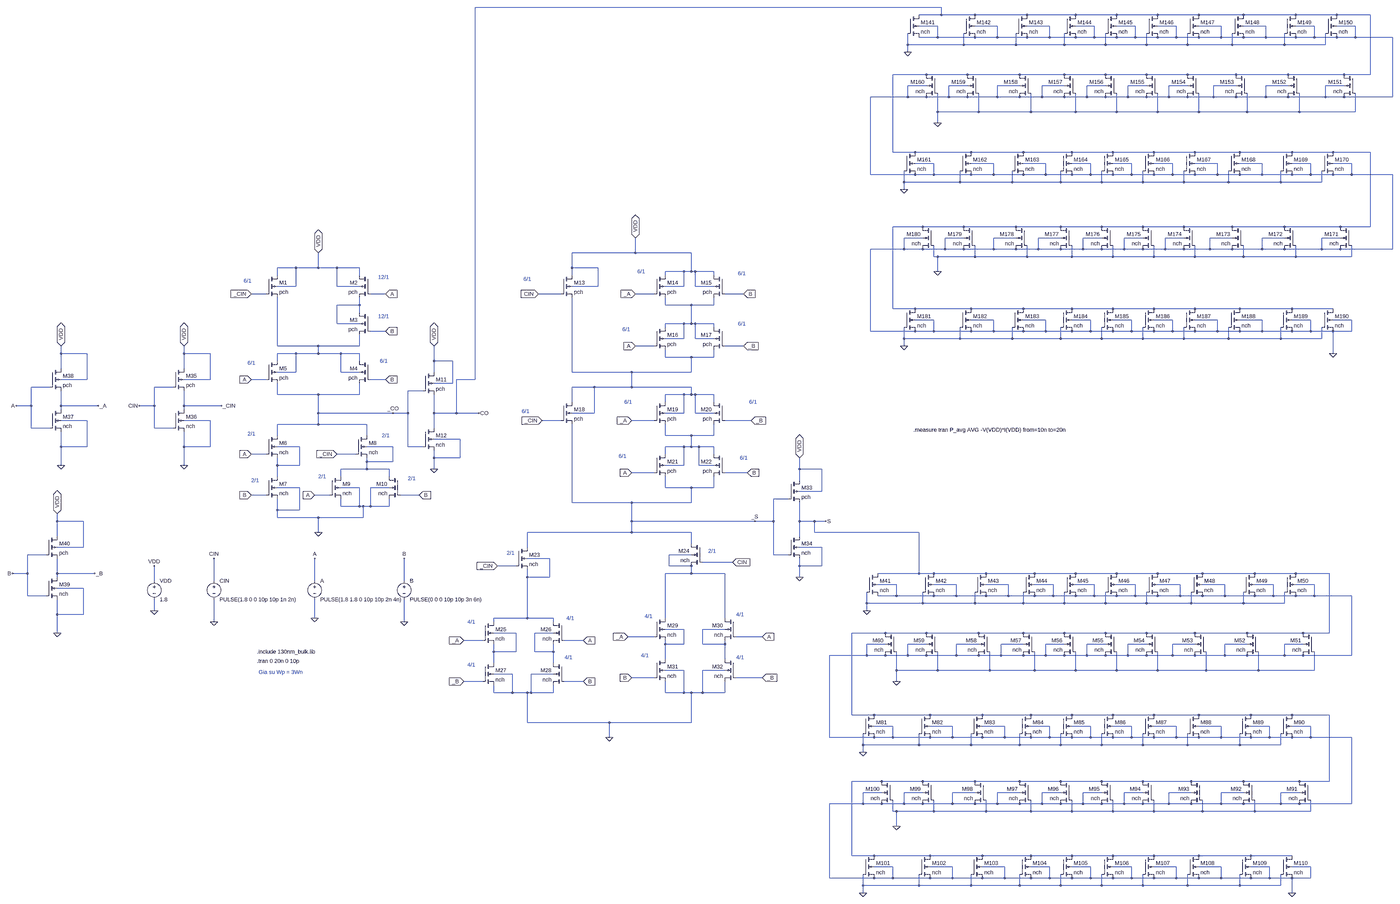
[diagram p0: schematic 22200162.asc, whole sheet]
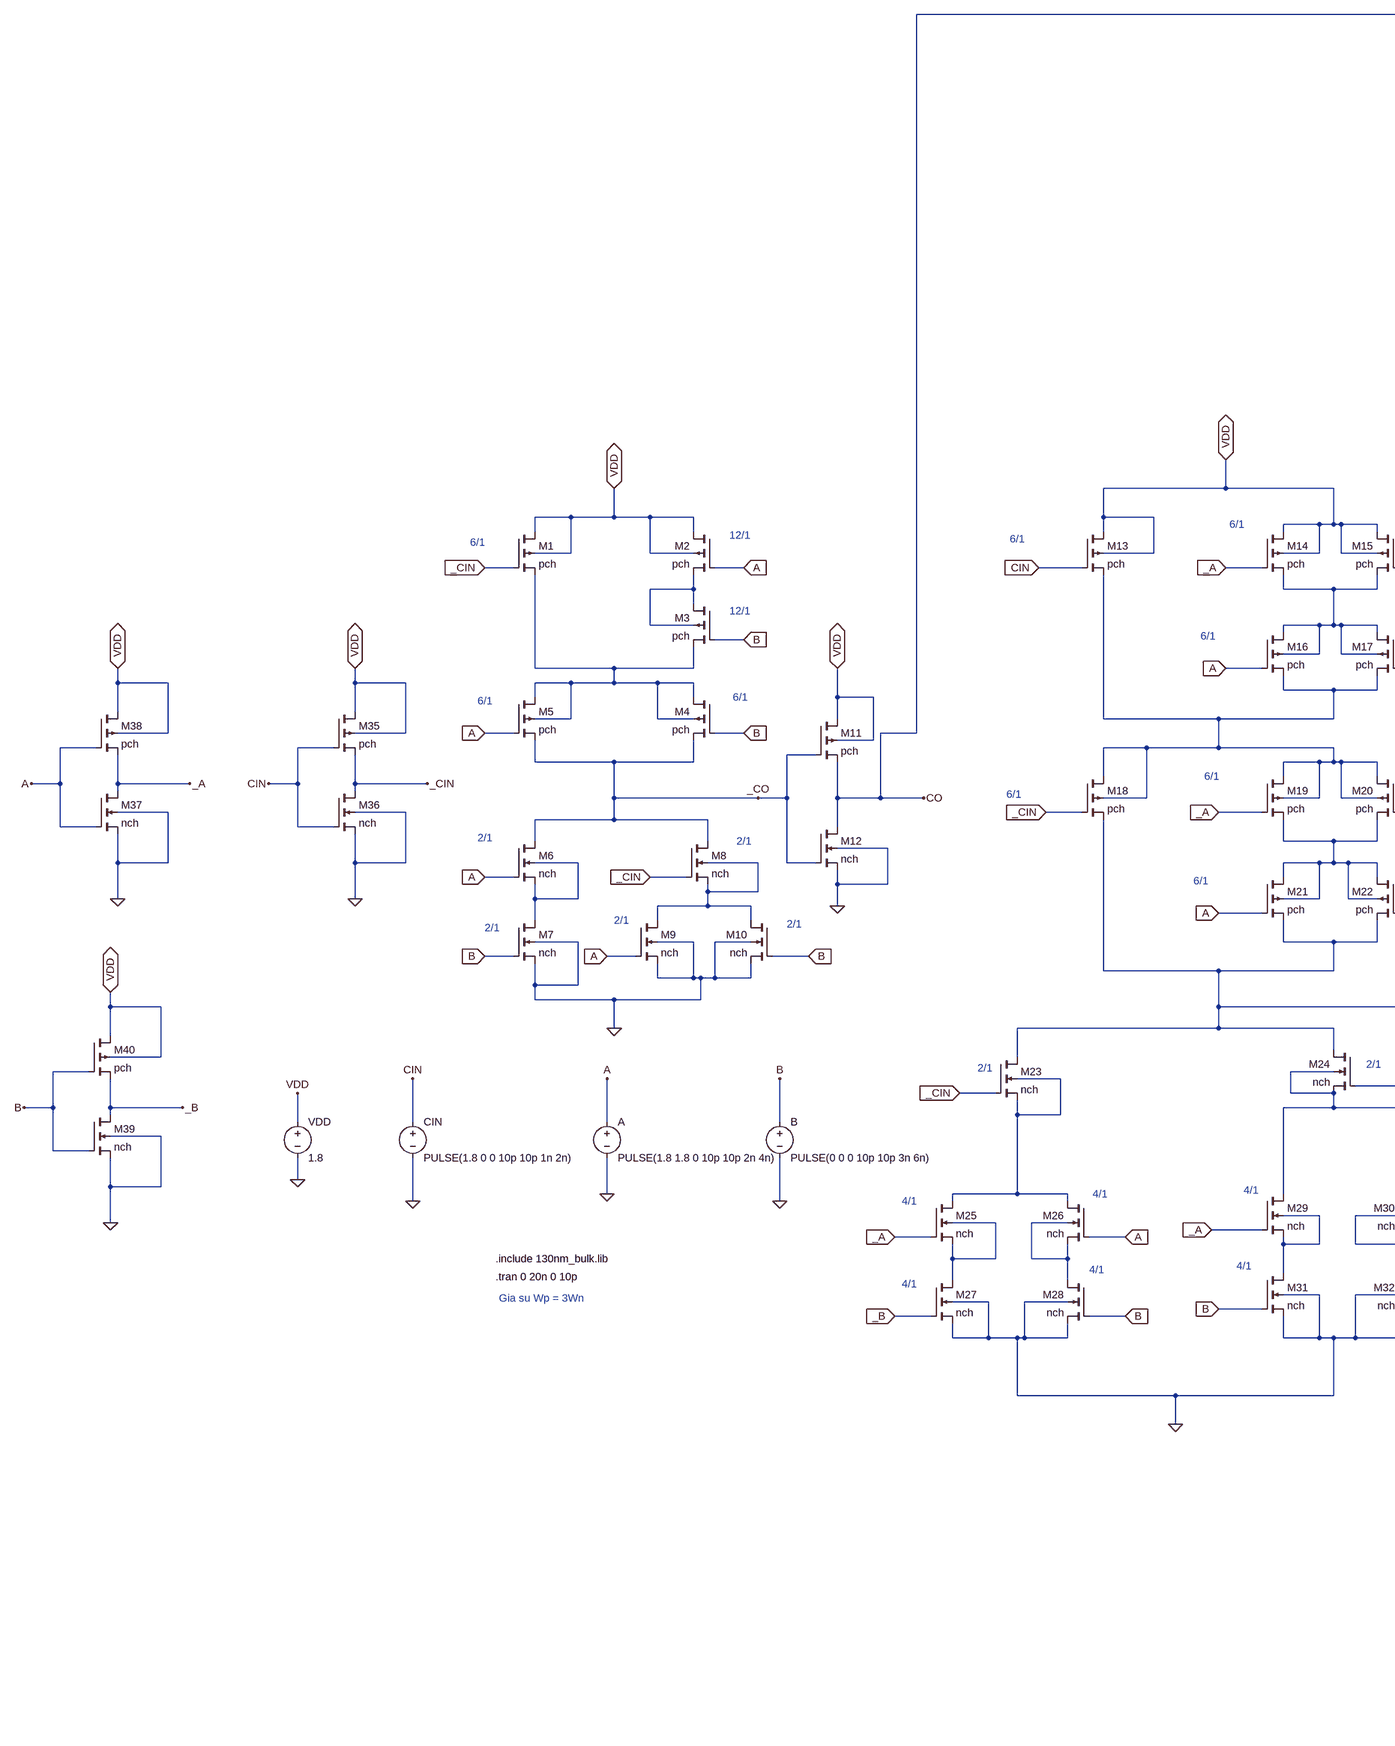
[diagram p1: schematic 22200162.asc, part, row 1 of 1, column 1 of 2]
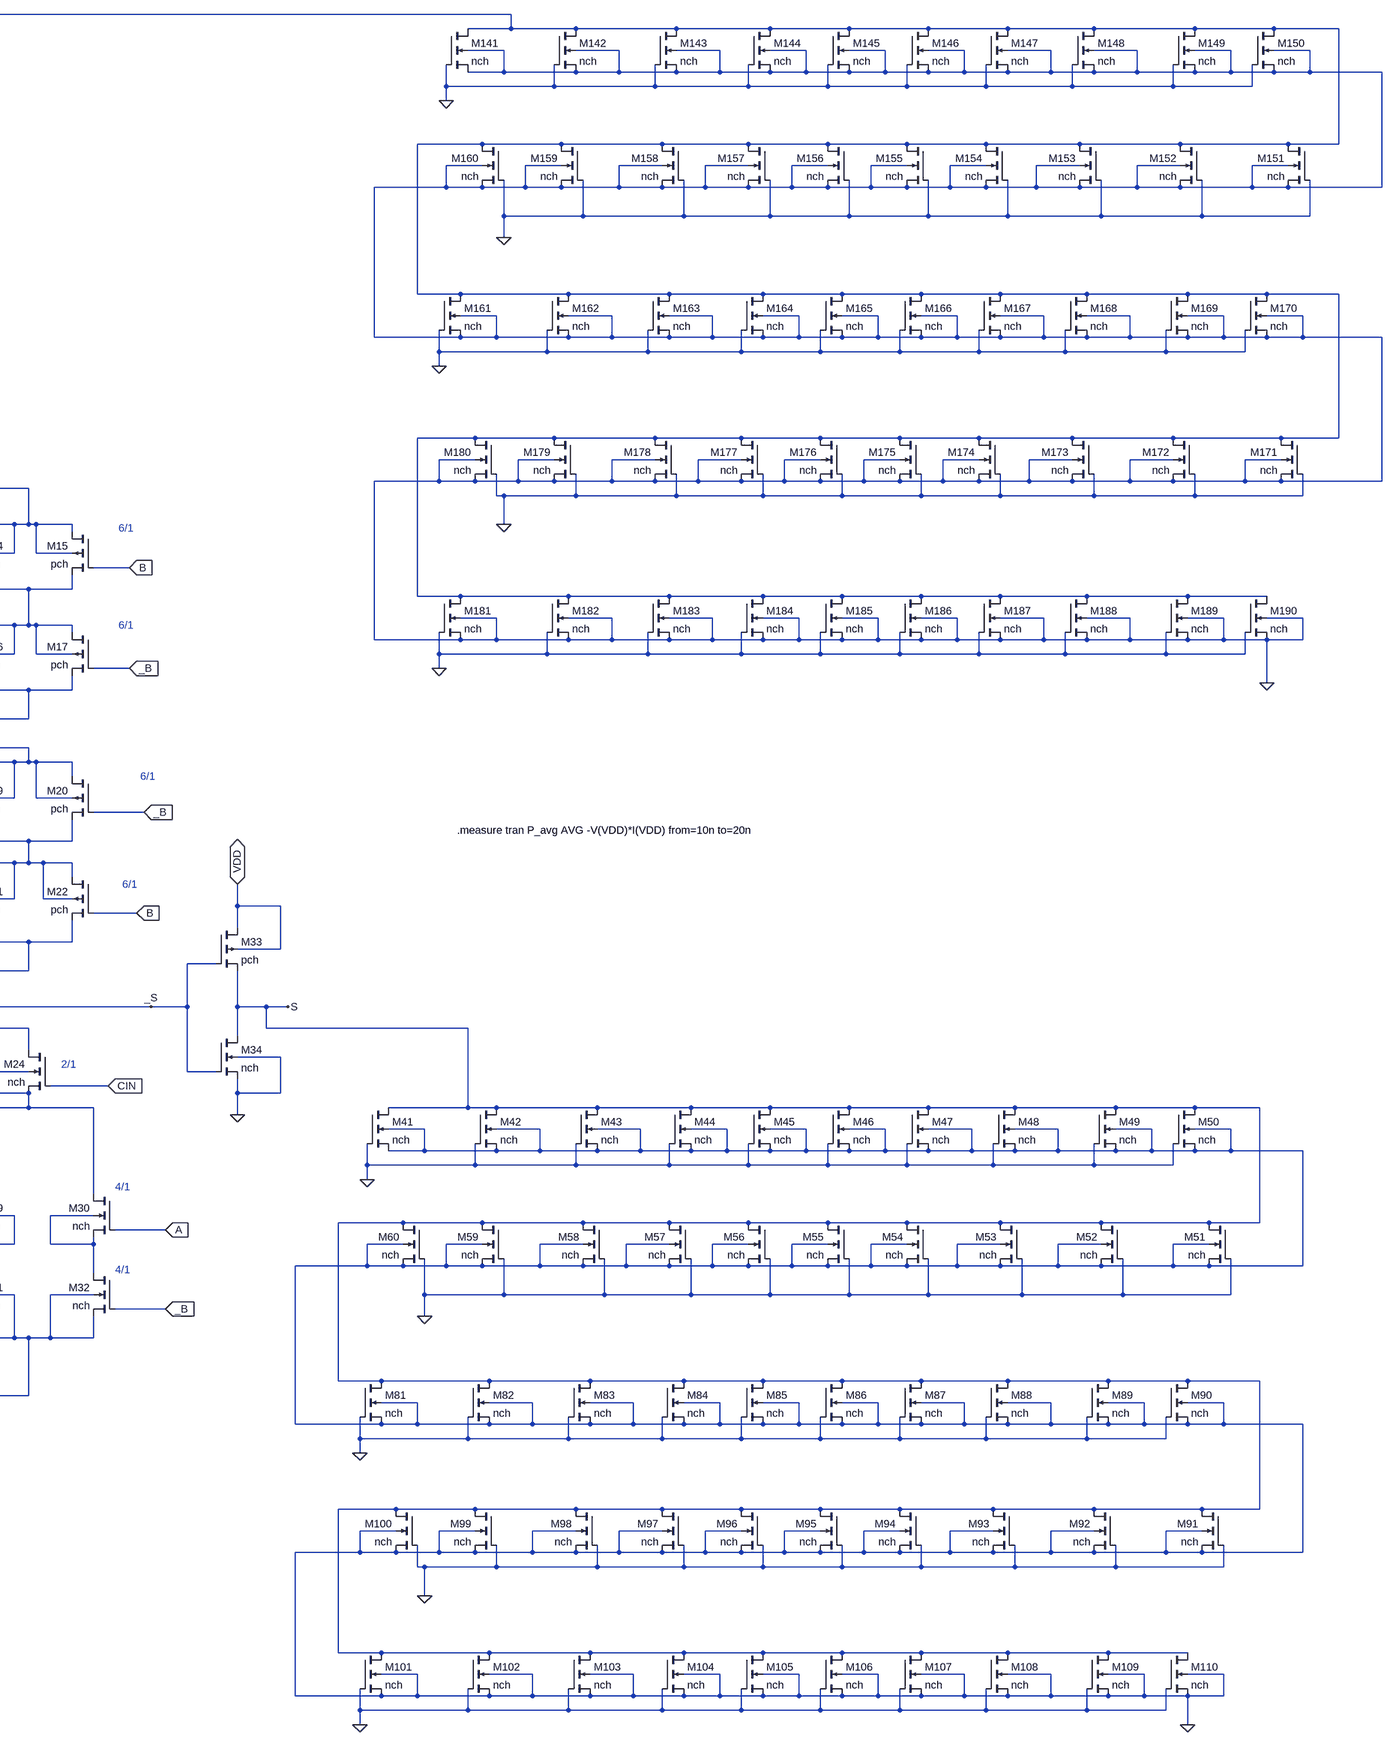
[diagram p2: schematic 22200162.asc, part, row 1 of 1, column 2 of 2]
22200162.asc, the LTspice schematic file:
Version 4.1
SHEET 1 7188 2788
WIRE 2864 -1120 864 -1120
WIRE 2864 -1088 2864 -1120
WIRE 2864 -1088 2768 -1088
WIRE 3008 -1088 2864 -1088
WIRE 3232 -1088 3008 -1088
WIRE 3440 -1088 3232 -1088
WIRE 3616 -1088 3440 -1088
WIRE 3792 -1088 3616 -1088
WIRE 3968 -1088 3792 -1088
WIRE 4160 -1088 3968 -1088
WIRE 4384 -1088 4160 -1088
WIRE 4560 -1088 4384 -1088
WIRE 4704 -1088 4560 -1088
WIRE 2848 -1040 2768 -1040
WIRE 3104 -1040 3008 -1040
WIRE 3328 -1040 3232 -1040
WIRE 3520 -1040 3440 -1040
WIRE 3696 -1040 3616 -1040
WIRE 3872 -1040 3792 -1040
WIRE 4064 -1040 3968 -1040
WIRE 4256 -1040 4160 -1040
WIRE 4464 -1040 4384 -1040
WIRE 4640 -1040 4560 -1040
WIRE 2848 -992 2848 -1040
WIRE 2848 -992 2768 -992
WIRE 3008 -992 2848 -992
WIRE 3104 -992 3104 -1040
WIRE 3104 -992 3008 -992
WIRE 3232 -992 3104 -992
WIRE 3328 -992 3328 -1040
WIRE 3328 -992 3232 -992
WIRE 3440 -992 3328 -992
WIRE 3520 -992 3520 -1040
WIRE 3520 -992 3440 -992
WIRE 3616 -992 3520 -992
WIRE 3696 -992 3696 -1040
WIRE 3696 -992 3616 -992
WIRE 3792 -992 3696 -992
WIRE 3872 -992 3872 -1040
WIRE 3872 -992 3792 -992
WIRE 3968 -992 3872 -992
WIRE 4064 -992 4064 -1040
WIRE 4064 -992 3968 -992
WIRE 4160 -992 4064 -992
WIRE 4256 -992 4256 -1040
WIRE 4256 -992 4160 -992
WIRE 4384 -992 4256 -992
WIRE 4464 -992 4464 -1040
WIRE 4464 -992 4384 -992
WIRE 4560 -992 4464 -992
WIRE 4640 -992 4640 -1040
WIRE 4640 -992 4560 -992
WIRE 4800 -992 4640 -992
WIRE 2720 -960 2720 -1008
WIRE 2960 -960 2960 -1008
WIRE 2960 -960 2720 -960
WIRE 3184 -960 3184 -1008
WIRE 3184 -960 2960 -960
WIRE 3392 -960 3392 -1008
WIRE 3392 -960 3184 -960
WIRE 3568 -960 3568 -1008
WIRE 3568 -960 3392 -960
WIRE 3744 -960 3744 -1008
WIRE 3744 -960 3568 -960
WIRE 3920 -960 3920 -1008
WIRE 3920 -960 3744 -960
WIRE 4112 -960 4112 -1008
WIRE 4112 -960 3920 -960
WIRE 4336 -960 4336 -1008
WIRE 4336 -960 4112 -960
WIRE 4512 -960 4512 -1008
WIRE 4512 -960 4336 -960
WIRE 2720 -928 2720 -960
WIRE 2800 -832 2656 -832
WIRE 2976 -832 2800 -832
WIRE 3200 -832 2976 -832
WIRE 3392 -832 3200 -832
WIRE 3568 -832 3392 -832
WIRE 3744 -832 3568 -832
WIRE 3920 -832 3744 -832
WIRE 4128 -832 3920 -832
WIRE 4352 -832 4128 -832
WIRE 4592 -832 4352 -832
WIRE 4704 -832 4704 -1088
WIRE 4704 -832 4592 -832
WIRE 2800 -784 2720 -784
WIRE 2976 -784 2896 -784
WIRE 3200 -784 3104 -784
WIRE 3392 -784 3296 -784
WIRE 3568 -784 3488 -784
WIRE 3744 -784 3664 -784
WIRE 3920 -784 3840 -784
WIRE 4128 -784 4032 -784
WIRE 4352 -784 4256 -784
WIRE 4592 -784 4512 -784
WIRE 2720 -736 2720 -784
WIRE 2720 -736 2560 -736
WIRE 2800 -736 2720 -736
WIRE 2896 -736 2896 -784
WIRE 2896 -736 2800 -736
WIRE 2976 -736 2896 -736
WIRE 3104 -736 3104 -784
WIRE 3104 -736 2976 -736
WIRE 3200 -736 3104 -736
WIRE 3296 -736 3296 -784
WIRE 3296 -736 3200 -736
WIRE 3392 -736 3296 -736
WIRE 3488 -736 3488 -784
WIRE 3488 -736 3392 -736
WIRE 3568 -736 3488 -736
WIRE 3664 -736 3664 -784
WIRE 3664 -736 3568 -736
WIRE 3744 -736 3664 -736
WIRE 3840 -736 3840 -784
WIRE 3840 -736 3744 -736
WIRE 3920 -736 3840 -736
WIRE 4032 -736 4032 -784
WIRE 4032 -736 3920 -736
WIRE 4128 -736 4032 -736
WIRE 4256 -736 4256 -784
WIRE 4256 -736 4128 -736
WIRE 4352 -736 4256 -736
WIRE 4512 -736 4512 -784
WIRE 4512 -736 4352 -736
WIRE 4592 -736 4512 -736
WIRE 4800 -736 4800 -992
WIRE 4800 -736 4592 -736
WIRE 2848 -672 2848 -752
WIRE 3024 -672 3024 -752
WIRE 3024 -672 2848 -672
WIRE 3248 -672 3248 -752
WIRE 3248 -672 3024 -672
WIRE 3440 -672 3440 -752
WIRE 3440 -672 3248 -672
WIRE 3616 -672 3616 -752
WIRE 3616 -672 3440 -672
WIRE 3792 -672 3792 -752
WIRE 3792 -672 3616 -672
WIRE 3968 -672 3968 -752
WIRE 3968 -672 3792 -672
WIRE 4176 -672 4176 -752
WIRE 4176 -672 3968 -672
WIRE 4400 -672 4400 -752
WIRE 4400 -672 4176 -672
WIRE 4640 -672 4640 -752
WIRE 4640 -672 4400 -672
WIRE 2848 -624 2848 -672
WIRE 2656 -480 2656 -832
WIRE 2752 -480 2656 -480
WIRE 2992 -480 2752 -480
WIRE 3216 -480 2992 -480
WIRE 3424 -480 3216 -480
WIRE 3600 -480 3424 -480
WIRE 3776 -480 3600 -480
WIRE 3952 -480 3776 -480
WIRE 4144 -480 3952 -480
WIRE 4368 -480 4144 -480
WIRE 4544 -480 4368 -480
WIRE 4704 -480 4544 -480
WIRE 2832 -432 2752 -432
WIRE 3088 -432 2992 -432
WIRE 3312 -432 3216 -432
WIRE 3504 -432 3424 -432
WIRE 3680 -432 3600 -432
WIRE 3856 -432 3776 -432
WIRE 4048 -432 3952 -432
WIRE 4240 -432 4144 -432
WIRE 4448 -432 4368 -432
WIRE 4624 -432 4544 -432
WIRE 2560 -384 2560 -736
WIRE 2752 -384 2560 -384
WIRE 2832 -384 2832 -432
WIRE 2832 -384 2752 -384
WIRE 2992 -384 2832 -384
WIRE 3088 -384 3088 -432
WIRE 3088 -384 2992 -384
WIRE 3216 -384 3088 -384
WIRE 3312 -384 3312 -432
WIRE 3312 -384 3216 -384
WIRE 3424 -384 3312 -384
WIRE 3504 -384 3504 -432
WIRE 3504 -384 3424 -384
WIRE 3600 -384 3504 -384
WIRE 3680 -384 3680 -432
WIRE 3680 -384 3600 -384
WIRE 3776 -384 3680 -384
WIRE 3856 -384 3856 -432
WIRE 3856 -384 3776 -384
WIRE 3952 -384 3856 -384
WIRE 4048 -384 4048 -432
WIRE 4048 -384 3952 -384
WIRE 4144 -384 4048 -384
WIRE 4240 -384 4240 -432
WIRE 4240 -384 4144 -384
WIRE 4368 -384 4240 -384
WIRE 4448 -384 4448 -432
WIRE 4448 -384 4368 -384
WIRE 4544 -384 4448 -384
WIRE 4624 -384 4624 -432
WIRE 4624 -384 4544 -384
WIRE 4800 -384 4624 -384
WIRE 2704 -352 2704 -400
WIRE 2944 -352 2944 -400
WIRE 2944 -352 2704 -352
WIRE 3168 -352 3168 -400
WIRE 3168 -352 2944 -352
WIRE 3376 -352 3376 -400
WIRE 3376 -352 3168 -352
WIRE 3552 -352 3552 -400
WIRE 3552 -352 3376 -352
WIRE 3728 -352 3728 -400
WIRE 3728 -352 3552 -352
WIRE 3904 -352 3904 -400
WIRE 3904 -352 3728 -352
WIRE 4096 -352 4096 -400
WIRE 4096 -352 3904 -352
WIRE 4320 -352 4320 -400
WIRE 4320 -352 4096 -352
WIRE 4496 -352 4496 -400
WIRE 4496 -352 4320 -352
WIRE 2704 -320 2704 -352
WIRE 2784 -160 2656 -160
WIRE 2960 -160 2784 -160
WIRE 3184 -160 2960 -160
WIRE 3376 -160 3184 -160
WIRE 3552 -160 3376 -160
WIRE 3728 -160 3552 -160
WIRE 3904 -160 3728 -160
WIRE 4112 -160 3904 -160
WIRE 4336 -160 4112 -160
WIRE 4576 -160 4336 -160
WIRE 4704 -160 4704 -480
WIRE 4704 -160 4576 -160
WIRE 2784 -112 2704 -112
WIRE 2960 -112 2880 -112
WIRE 3184 -112 3088 -112
WIRE 3376 -112 3280 -112
WIRE 3552 -112 3472 -112
WIRE 3728 -112 3648 -112
WIRE 3904 -112 3824 -112
WIRE 4112 -112 4016 -112
WIRE 4336 -112 4240 -112
WIRE 4576 -112 4496 -112
WIRE 2704 -64 2704 -112
WIRE 2704 -64 2560 -64
WIRE 2784 -64 2704 -64
WIRE 2880 -64 2880 -112
WIRE 2880 -64 2784 -64
WIRE 2960 -64 2880 -64
WIRE 3088 -64 3088 -112
WIRE 3088 -64 2960 -64
WIRE 3184 -64 3088 -64
WIRE 3280 -64 3280 -112
WIRE 3280 -64 3184 -64
WIRE 3376 -64 3280 -64
WIRE 3472 -64 3472 -112
WIRE 3472 -64 3376 -64
WIRE 3552 -64 3472 -64
WIRE 3648 -64 3648 -112
WIRE 3648 -64 3552 -64
WIRE 3728 -64 3648 -64
WIRE 3824 -64 3824 -112
WIRE 3824 -64 3728 -64
WIRE 3904 -64 3824 -64
WIRE 4016 -64 4016 -112
WIRE 4016 -64 3904 -64
WIRE 4112 -64 4016 -64
WIRE 4240 -64 4240 -112
WIRE 4240 -64 4112 -64
WIRE 4336 -64 4240 -64
WIRE 4496 -64 4496 -112
WIRE 4496 -64 4336 -64
WIRE 4576 -64 4496 -64
WIRE 4800 -64 4800 -384
WIRE 4800 -64 4576 -64
WIRE 1552 -48 1552 -112
WIRE 1552 -48 1280 -48
WIRE 1792 -48 1552 -48
WIRE 2832 -32 2832 -80
WIRE 2848 -32 2832 -32
WIRE 3008 -32 3008 -80
WIRE 3008 -32 2848 -32
WIRE 3232 -32 3232 -80
WIRE 3232 -32 3008 -32
WIRE 3424 -32 3424 -80
WIRE 3424 -32 3232 -32
WIRE 3600 -32 3600 -80
WIRE 3600 -32 3424 -32
WIRE 3776 -32 3776 -80
WIRE 3776 -32 3600 -32
WIRE 3952 -32 3952 -80
WIRE 3952 -32 3776 -32
WIRE 4160 -32 4160 -80
WIRE 4160 -32 3952 -32
WIRE 4384 -32 4384 -80
WIRE 4384 -32 4160 -32
WIRE 4624 -32 4624 -80
WIRE 4624 -32 4384 -32
WIRE 96 16 16 16
WIRE 192 16 192 -48
WIRE 192 16 96 16
WIRE 272 16 192 16
WIRE 368 16 272 16
WIRE 1280 16 1280 -48
WIRE 1392 16 1280 16
WIRE 1760 32 1680 32
WIRE 1792 32 1792 -48
WIRE 1792 32 1760 32
WIRE 1808 32 1792 32
WIRE 1888 32 1808 32
WIRE 2848 32 2848 -32
WIRE 16 48 16 16
WIRE 368 48 368 16
WIRE 1280 48 1280 16
WIRE 1680 48 1680 32
WIRE 1888 48 1888 32
WIRE 96 96 96 16
WIRE 96 96 16 96
WIRE 272 96 272 16
WIRE 368 96 272 96
WIRE 1392 96 1392 16
WIRE 1392 96 1280 96
WIRE 1760 96 1760 32
WIRE 1760 96 1680 96
WIRE 1808 96 1808 32
WIRE 1888 96 1808 96
WIRE -32 128 -96 128
WIRE 480 128 416 128
WIRE 1232 128 1136 128
WIRE 1632 128 1552 128
WIRE 2016 128 1936 128
WIRE 368 176 368 144
WIRE 368 176 272 176
WIRE 1680 176 1680 144
WIRE 1792 176 1680 176
WIRE 1888 176 1888 144
WIRE 1888 176 1792 176
WIRE 2656 192 2656 -160
WIRE 2752 192 2656 192
WIRE 2992 192 2752 192
WIRE 3216 192 2992 192
WIRE 3424 192 3216 192
WIRE 3600 192 3424 192
WIRE 3776 192 3600 192
WIRE 3952 192 3776 192
WIRE 4144 192 3952 192
WIRE 4368 192 4144 192
WIRE 4544 192 4368 192
WIRE 368 208 368 176
WIRE 2832 240 2752 240
WIRE 3088 240 2992 240
WIRE 3312 240 3216 240
WIRE 3504 240 3424 240
WIRE 3680 240 3600 240
WIRE 3856 240 3776 240
WIRE 4048 240 3952 240
WIRE 4240 240 4144 240
WIRE 4448 240 4368 240
WIRE 4624 240 4544 240
WIRE 272 256 272 176
WIRE 368 256 272 256
WIRE 1760 256 1680 256
WIRE 1792 256 1792 176
WIRE 1792 256 1760 256
WIRE 1808 256 1792 256
WIRE 1888 256 1808 256
WIRE 1680 272 1680 256
WIRE 1888 272 1888 256
WIRE 480 288 416 288
WIRE 2560 288 2560 -64
WIRE 2752 288 2560 288
WIRE 2832 288 2832 240
WIRE 2832 288 2752 288
WIRE 2992 288 2832 288
WIRE 3088 288 3088 240
WIRE 3088 288 2992 288
WIRE 3216 288 3088 288
WIRE 3312 288 3312 240
WIRE 3312 288 3216 288
WIRE 3424 288 3312 288
WIRE 3504 288 3504 240
WIRE 3504 288 3424 288
WIRE 3600 288 3504 288
WIRE 3680 288 3680 240
WIRE 3680 288 3600 288
WIRE 3776 288 3680 288
WIRE 3856 288 3856 240
WIRE 3856 288 3776 288
WIRE 3952 288 3856 288
WIRE 4048 288 4048 240
WIRE 4048 288 3952 288
WIRE 4144 288 4048 288
WIRE 4240 288 4240 240
WIRE 4240 288 4144 288
WIRE 4368 288 4240 288
WIRE 4448 288 4448 240
WIRE 4448 288 4368 288
WIRE 4544 288 4448 288
WIRE 4624 288 4624 240
WIRE 4624 288 4544 288
WIRE 1760 320 1760 256
WIRE 1760 320 1680 320
WIRE 1808 320 1808 256
WIRE 1888 320 1808 320
WIRE 2704 320 2704 272
WIRE 2944 320 2944 272
WIRE 2944 320 2704 320
WIRE 3168 320 3168 272
WIRE 3168 320 2944 320
WIRE 3376 320 3376 272
WIRE 3376 320 3168 320
WIRE 3552 320 3552 272
WIRE 3552 320 3376 320
WIRE 3728 320 3728 272
WIRE 3728 320 3552 320
WIRE 3904 320 3904 272
WIRE 3904 320 3728 320
WIRE 4096 320 4096 272
WIRE 4096 320 3904 320
WIRE 4320 320 4320 272
WIRE 4320 320 4096 320
WIRE 4496 320 4496 272
WIRE 4496 320 4320 320
WIRE 16 352 16 144
WIRE 192 352 16 352
WIRE 368 352 368 304
WIRE 368 352 192 352
WIRE 1632 352 1552 352
WIRE 2016 352 1936 352
WIRE 2704 352 2704 320
WIRE -912 384 -912 352
WIRE -800 384 -912 384
WIRE -384 384 -384 352
WIRE -272 384 -384 384
WIRE 96 384 16 384
WIRE 192 384 192 352
WIRE 192 384 96 384
WIRE 288 384 192 384
WIRE 368 384 288 384
WIRE 4544 384 4544 288
WIRE 1680 400 1680 368
WIRE 1792 400 1680 400
WIRE 1888 400 1888 368
WIRE 1888 400 1792 400
WIRE 16 416 16 384
WIRE 368 416 368 384
WIRE 688 416 688 352
WIRE 768 416 688 416
WIRE -912 448 -912 384
WIRE -384 448 -384 384
WIRE 96 464 96 384
WIRE 96 464 16 464
WIRE 288 464 288 384
WIRE 368 464 288 464
WIRE 688 464 688 416
WIRE 1280 464 1280 144
WIRE 1536 464 1280 464
WIRE 1792 464 1792 400
WIRE 1792 464 1536 464
WIRE -800 496 -800 384
WIRE -800 496 -912 496
WIRE -272 496 -272 384
WIRE -272 496 -384 496
WIRE -32 496 -96 496
WIRE 480 496 416 496
WIRE 864 496 864 -1120
WIRE 864 496 784 496
WIRE 768 512 768 416
WIRE 768 512 688 512
WIRE -960 528 -1040 528
WIRE -432 528 -512 528
WIRE 1376 528 1280 528
WIRE 1536 528 1536 464
WIRE 1536 528 1376 528
WIRE 1792 528 1536 528
WIRE 640 544 576 544
WIRE 16 560 16 512
WIRE 192 560 16 560
WIRE 368 560 368 512
WIRE 368 560 192 560
WIRE 1760 560 1680 560
WIRE 1792 560 1792 528
WIRE 1792 560 1760 560
WIRE 1808 560 1792 560
WIRE 1888 560 1808 560
WIRE 1280 592 1280 528
WIRE 1680 592 1680 560
WIRE 1888 592 1888 560
WIRE -1040 608 -1040 528
WIRE -1040 608 -1104 608
WIRE -912 608 -912 544
WIRE -752 608 -912 608
WIRE -512 608 -512 528
WIRE -512 608 -576 608
WIRE -384 608 -384 544
WIRE -224 608 -384 608
WIRE -912 624 -912 608
WIRE -384 624 -384 608
WIRE 192 640 192 560
WIRE 512 640 192 640
WIRE 576 640 576 544
WIRE 576 640 512 640
WIRE 688 640 688 560
WIRE 784 640 784 496
WIRE 784 640 688 640
WIRE 880 640 784 640
WIRE 1376 640 1376 528
WIRE 1376 640 1280 640
WIRE 1760 640 1760 560
WIRE 1760 640 1680 640
WIRE 1808 640 1808 560
WIRE 1888 640 1808 640
WIRE -800 672 -912 672
WIRE -272 672 -384 672
WIRE 1232 672 1152 672
WIRE 1632 672 1536 672
WIRE 2048 672 1936 672
WIRE 192 688 192 640
WIRE 192 688 16 688
WIRE 400 688 192 688
WIRE -1040 704 -1040 608
WIRE -960 704 -1040 704
WIRE -512 704 -512 608
WIRE -432 704 -512 704
WIRE 688 704 688 640
WIRE 16 736 16 688
WIRE 400 736 400 688
WIRE 1680 736 1680 688
WIRE 1792 736 1680 736
WIRE 1888 736 1888 688
WIRE 1888 736 1792 736
WIRE 800 752 688 752
WIRE -912 784 -912 720
WIRE -800 784 -800 672
WIRE -800 784 -912 784
WIRE -384 784 -384 720
WIRE -272 784 -272 672
WIRE -272 784 -384 784
WIRE 112 784 16 784
WIRE 512 784 400 784
WIRE 576 784 576 640
WIRE 640 784 576 784
WIRE 1760 784 1680 784
WIRE 1792 784 1792 736
WIRE 1792 784 1760 784
WIRE 1824 784 1792 784
WIRE 1888 784 1824 784
WIRE -32 816 -96 816
WIRE 352 816 272 816
WIRE 1680 816 1680 784
WIRE 1888 816 1888 784
WIRE 688 832 688 800
WIRE 800 832 800 752
WIRE 800 832 688 832
WIRE 400 848 400 832
WIRE 512 848 512 784
WIRE 512 848 400 848
WIRE -912 864 -912 784
WIRE -384 864 -384 784
WIRE 16 864 16 832
WIRE 112 864 112 784
WIRE 112 864 16 864
WIRE 1760 864 1760 784
WIRE 1760 864 1680 864
WIRE 1824 864 1824 784
WIRE 1888 864 1824 864
WIRE 400 880 400 848
WIRE 400 880 288 880
WIRE 496 880 400 880
WIRE 688 880 688 832
WIRE 2256 880 2256 832
WIRE 2352 880 2256 880
WIRE 1632 896 1536 896
WIRE 2032 896 1936 896
WIRE 16 912 16 864
WIRE 288 912 288 880
WIRE 496 912 496 880
WIRE 2256 928 2256 880
WIRE 112 960 16 960
WIRE 368 960 288 960
WIRE 496 960 416 960
WIRE 1680 960 1680 912
WIRE 1792 960 1680 960
WIRE 1888 960 1888 912
WIRE 1888 960 1792 960
WIRE 2352 976 2352 880
WIRE 2352 976 2256 976
WIRE -32 992 -96 992
WIRE 240 992 176 992
WIRE 624 992 544 992
WIRE 2208 1008 2144 1008
WIRE 1280 1024 1280 688
WIRE 1536 1024 1280 1024
WIRE 1792 1024 1792 960
WIRE 1792 1024 1536 1024
WIRE 288 1040 288 1008
WIRE 368 1040 368 960
WIRE 368 1040 288 1040
WIRE 384 1040 368 1040
WIRE 416 1040 416 960
WIRE 416 1040 384 1040
WIRE 496 1040 496 1008
WIRE 496 1040 416 1040
WIRE 16 1056 16 1008
WIRE 112 1056 112 960
WIRE 112 1056 16 1056
WIRE 16 1088 16 1056
WIRE 192 1088 16 1088
WIRE 384 1088 384 1040
WIRE 384 1088 192 1088
WIRE -928 1104 -928 1072
WIRE -816 1104 -928 1104
WIRE 1536 1104 1536 1024
WIRE 2064 1104 1536 1104
WIRE 2144 1104 2144 1008
WIRE 2144 1104 2064 1104
WIRE 2256 1104 2256 1024
WIRE 2320 1104 2256 1104
WIRE 2368 1104 2320 1104
WIRE 192 1152 192 1088
WIRE 1536 1152 1536 1104
WIRE 1536 1152 1088 1152
WIRE 1792 1152 1536 1152
WIRE 2320 1152 2320 1104
WIRE 2768 1152 2320 1152
WIRE -928 1168 -928 1104
WIRE 2256 1168 2256 1104
WIRE 1792 1200 1792 1152
WIRE -816 1216 -816 1104
WIRE -816 1216 -928 1216
WIRE 1088 1216 1088 1152
WIRE 2352 1216 2256 1216
WIRE -976 1248 -1056 1248
WIRE 1792 1248 1696 1248
WIRE 2144 1248 2144 1104
WIRE 2208 1248 2144 1248
WIRE 1184 1264 1088 1264
WIRE 1968 1280 1840 1280
WIRE 1040 1296 960 1296
WIRE 1696 1296 1696 1248
WIRE 1792 1296 1696 1296
WIRE 2256 1296 2256 1264
WIRE 2352 1296 2352 1216
WIRE 2352 1296 2256 1296
WIRE -1056 1328 -1056 1248
WIRE -1056 1328 -1120 1328
WIRE -928 1328 -928 1264
WIRE -768 1328 -928 1328
WIRE 1792 1328 1792 1296
WIRE 1792 1328 1680 1328
WIRE 1936 1328 1792 1328
WIRE 2768 1328 2768 1152
WIRE 2768 1328 2592 1328
WIRE 2832 1328 2768 1328
WIRE 3056 1328 2832 1328
WIRE 3264 1328 3056 1328
WIRE 3440 1328 3264 1328
WIRE 3616 1328 3440 1328
WIRE 3792 1328 3616 1328
WIRE 3984 1328 3792 1328
WIRE 4208 1328 3984 1328
WIRE 4384 1328 4208 1328
WIRE 4528 1328 4384 1328
WIRE -928 1344 -928 1328
WIRE 1088 1344 1088 1312
WIRE 1184 1344 1184 1264
WIRE 1184 1344 1088 1344
WIRE 2256 1344 2256 1296
WIRE -512 1360 -512 1296
WIRE -256 1360 -256 1264
WIRE 176 1360 176 1264
WIRE 560 1360 560 1264
WIRE 2672 1376 2592 1376
WIRE 2928 1376 2832 1376
WIRE 3152 1376 3056 1376
WIRE 3344 1376 3264 1376
WIRE 3520 1376 3440 1376
WIRE 3696 1376 3616 1376
WIRE 3888 1376 3792 1376
WIRE 4080 1376 3984 1376
WIRE 4288 1376 4208 1376
WIRE 4464 1376 4384 1376
WIRE -816 1392 -928 1392
WIRE -1056 1424 -1056 1328
WIRE -976 1424 -1056 1424
WIRE 2672 1424 2672 1376
WIRE 2672 1424 2592 1424
WIRE 2832 1424 2672 1424
WIRE 2928 1424 2928 1376
WIRE 2928 1424 2832 1424
WIRE 3056 1424 2928 1424
WIRE 3152 1424 3152 1376
WIRE 3152 1424 3056 1424
WIRE 3264 1424 3152 1424
WIRE 3344 1424 3344 1376
WIRE 3344 1424 3264 1424
WIRE 3440 1424 3344 1424
WIRE 3520 1424 3520 1376
WIRE 3520 1424 3440 1424
WIRE 3616 1424 3520 1424
WIRE 3696 1424 3696 1376
WIRE 3696 1424 3616 1424
WIRE 3792 1424 3696 1424
WIRE 3888 1424 3888 1376
WIRE 3888 1424 3792 1424
WIRE 3984 1424 3888 1424
WIRE 4080 1424 4080 1376
WIRE 4080 1424 3984 1424
WIRE 4208 1424 4080 1424
WIRE 4288 1424 4288 1376
WIRE 4288 1424 4208 1424
WIRE 4384 1424 4288 1424
WIRE 4464 1424 4464 1376
WIRE 4464 1424 4384 1424
WIRE 4624 1424 4464 1424
WIRE 2544 1456 2544 1408
WIRE 2784 1456 2784 1408
WIRE 2784 1456 2544 1456
WIRE 3008 1456 3008 1408
WIRE 3008 1456 2784 1456
WIRE 3216 1456 3216 1408
WIRE 3216 1456 3008 1456
WIRE 3392 1456 3392 1408
WIRE 3392 1456 3216 1456
WIRE 3568 1456 3568 1408
WIRE 3568 1456 3392 1456
WIRE 3744 1456 3744 1408
WIRE 3744 1456 3568 1456
WIRE 3936 1456 3936 1408
WIRE 3936 1456 3744 1456
WIRE 4160 1456 4160 1408
WIRE 4160 1456 3936 1456
WIRE 4336 1456 4336 1408
WIRE 4336 1456 4160 1456
WIRE -512 1488 -512 1440
WIRE 2544 1488 2544 1456
WIRE -928 1504 -928 1440
WIRE -816 1504 -816 1392
WIRE -816 1504 -928 1504
WIRE 176 1520 176 1440
WIRE 1088 1520 1088 1344
WIRE 1088 1520 944 1520
WIRE 1200 1520 1088 1520
WIRE 1680 1520 1680 1328
WIRE 1936 1520 1936 1328
WIRE -256 1536 -256 1440
WIRE 560 1536 560 1440
WIRE 944 1536 944 1520
WIRE 1200 1536 1200 1520
WIRE 1760 1568 1680 1568
WIRE 1936 1568 1840 1568
WIRE -928 1584 -928 1504
WIRE 1040 1584 944 1584
WIRE 1200 1584 1120 1584
WIRE 2624 1584 2480 1584
WIRE 2800 1584 2624 1584
WIRE 3024 1584 2800 1584
WIRE 3216 1584 3024 1584
WIRE 3392 1584 3216 1584
WIRE 3568 1584 3392 1584
WIRE 3744 1584 3568 1584
WIRE 3952 1584 3744 1584
WIRE 4176 1584 3952 1584
WIRE 4416 1584 4176 1584
WIRE 4528 1584 4528 1328
WIRE 4528 1584 4416 1584
WIRE 1632 1600 1520 1600
WIRE 2096 1600 1984 1600
WIRE 896 1616 816 1616
WIRE 1328 1616 1248 1616
WIRE 1680 1632 1680 1616
WIRE 1760 1632 1760 1568
WIRE 1760 1632 1680 1632
WIRE 1840 1632 1840 1568
WIRE 1936 1632 1936 1616
WIRE 1936 1632 1840 1632
WIRE 2624 1632 2544 1632
WIRE 2800 1632 2720 1632
WIRE 3024 1632 2928 1632
WIRE 3216 1632 3120 1632
WIRE 3392 1632 3312 1632
WIRE 3568 1632 3488 1632
WIRE 3744 1632 3664 1632
WIRE 3952 1632 3856 1632
WIRE 4176 1632 4080 1632
WIRE 4416 1632 4336 1632
WIRE 944 1664 944 1632
WIRE 1040 1664 1040 1584
WIRE 1040 1664 944 1664
WIRE 1120 1664 1120 1584
WIRE 1200 1664 1200 1632
WIRE 1200 1664 1120 1664
WIRE 2544 1680 2544 1632
WIRE 2544 1680 2384 1680
WIRE 2624 1680 2544 1680
WIRE 2720 1680 2720 1632
WIRE 2720 1680 2624 1680
WIRE 2800 1680 2720 1680
WIRE 2928 1680 2928 1632
WIRE 2928 1680 2800 1680
WIRE 3024 1680 2928 1680
WIRE 3120 1680 3120 1632
WIRE 3120 1680 3024 1680
WIRE 3216 1680 3120 1680
WIRE 3312 1680 3312 1632
WIRE 3312 1680 3216 1680
WIRE 3392 1680 3312 1680
WIRE 3488 1680 3488 1632
WIRE 3488 1680 3392 1680
WIRE 3568 1680 3488 1680
WIRE 3664 1680 3664 1632
WIRE 3664 1680 3568 1680
WIRE 3744 1680 3664 1680
WIRE 3856 1680 3856 1632
WIRE 3856 1680 3744 1680
WIRE 3952 1680 3856 1680
WIRE 4080 1680 4080 1632
WIRE 4080 1680 3952 1680
WIRE 4176 1680 4080 1680
WIRE 4336 1680 4336 1632
WIRE 4336 1680 4176 1680
WIRE 4416 1680 4336 1680
WIRE 4624 1680 4624 1424
WIRE 4624 1680 4416 1680
WIRE 1680 1696 1680 1632
WIRE 1936 1696 1936 1632
WIRE 944 1712 944 1664
WIRE 1200 1712 1200 1664
WIRE 1760 1744 1680 1744
WIRE 1936 1744 1840 1744
WIRE 2672 1744 2672 1664
WIRE 2848 1744 2848 1664
WIRE 2848 1744 2672 1744
WIRE 3072 1744 3072 1664
WIRE 3072 1744 2848 1744
WIRE 3264 1744 3264 1664
WIRE 3264 1744 3072 1744
WIRE 3440 1744 3440 1664
WIRE 3440 1744 3264 1744
WIRE 3616 1744 3616 1664
WIRE 3616 1744 3440 1744
WIRE 3792 1744 3792 1664
WIRE 3792 1744 3616 1744
WIRE 4000 1744 4000 1664
WIRE 4000 1744 3792 1744
WIRE 4224 1744 4224 1664
WIRE 4224 1744 4000 1744
WIRE 4464 1744 4464 1664
WIRE 4464 1744 4224 1744
WIRE 1024 1760 944 1760
WIRE 1200 1760 1104 1760
WIRE 1632 1776 1536 1776
WIRE 2096 1776 1984 1776
WIRE 896 1792 816 1792
WIRE 1328 1792 1248 1792
WIRE 2672 1792 2672 1744
WIRE 944 1840 944 1808
WIRE 1024 1840 1024 1760
WIRE 1024 1840 944 1840
WIRE 1088 1840 1024 1840
WIRE 1104 1840 1104 1760
WIRE 1104 1840 1088 1840
WIRE 1200 1840 1200 1808
WIRE 1200 1840 1104 1840
WIRE 1680 1840 1680 1792
WIRE 1760 1840 1760 1744
WIRE 1760 1840 1680 1840
WIRE 1792 1840 1760 1840
WIRE 1840 1840 1840 1744
WIRE 1840 1840 1792 1840
WIRE 1936 1840 1936 1792
WIRE 1936 1840 1840 1840
WIRE 2480 1936 2480 1584
WIRE 2576 1936 2480 1936
WIRE 2816 1936 2576 1936
WIRE 3040 1936 2816 1936
WIRE 3248 1936 3040 1936
WIRE 3424 1936 3248 1936
WIRE 3600 1936 3424 1936
WIRE 3776 1936 3600 1936
WIRE 3968 1936 3776 1936
WIRE 4192 1936 3968 1936
WIRE 4368 1936 4192 1936
WIRE 4528 1936 4368 1936
WIRE 1088 1968 1088 1840
WIRE 1440 1968 1088 1968
WIRE 1792 1968 1792 1840
WIRE 1792 1968 1440 1968
WIRE 2656 1984 2576 1984
WIRE 2912 1984 2816 1984
WIRE 3136 1984 3040 1984
WIRE 3328 1984 3248 1984
WIRE 3504 1984 3424 1984
WIRE 3680 1984 3600 1984
WIRE 3872 1984 3776 1984
WIRE 4064 1984 3968 1984
WIRE 4272 1984 4192 1984
WIRE 4448 1984 4368 1984
WIRE 1440 2032 1440 1968
WIRE 2384 2032 2384 1680
WIRE 2576 2032 2384 2032
WIRE 2656 2032 2656 1984
WIRE 2656 2032 2576 2032
WIRE 2816 2032 2656 2032
WIRE 2912 2032 2912 1984
WIRE 2912 2032 2816 2032
WIRE 3040 2032 2912 2032
WIRE 3136 2032 3136 1984
WIRE 3136 2032 3040 2032
WIRE 3248 2032 3136 2032
WIRE 3328 2032 3328 1984
WIRE 3328 2032 3248 2032
WIRE 3424 2032 3328 2032
WIRE 3504 2032 3504 1984
WIRE 3504 2032 3424 2032
WIRE 3600 2032 3504 2032
WIRE 3680 2032 3680 1984
WIRE 3680 2032 3600 2032
WIRE 3776 2032 3680 2032
WIRE 3872 2032 3872 1984
WIRE 3872 2032 3776 2032
WIRE 3968 2032 3872 2032
WIRE 4064 2032 4064 1984
WIRE 4064 2032 3968 2032
WIRE 4192 2032 4064 2032
WIRE 4272 2032 4272 1984
WIRE 4272 2032 4192 2032
WIRE 4368 2032 4272 2032
WIRE 4448 2032 4448 1984
WIRE 4448 2032 4368 2032
WIRE 4624 2032 4448 2032
WIRE 2528 2064 2528 2016
WIRE 2768 2064 2768 2016
WIRE 2768 2064 2528 2064
WIRE 2992 2064 2992 2016
WIRE 2992 2064 2768 2064
WIRE 3200 2064 3200 2016
WIRE 3200 2064 2992 2064
WIRE 3376 2064 3376 2016
WIRE 3376 2064 3200 2064
WIRE 3552 2064 3552 2016
WIRE 3552 2064 3376 2064
WIRE 3728 2064 3728 2016
WIRE 3728 2064 3552 2064
WIRE 3920 2064 3920 2016
WIRE 3920 2064 3728 2064
WIRE 4144 2064 4144 2016
WIRE 4144 2064 3920 2064
WIRE 4320 2064 4320 2016
WIRE 4320 2064 4144 2064
WIRE 2528 2096 2528 2064
WIRE 2608 2256 2480 2256
WIRE 2784 2256 2608 2256
WIRE 3008 2256 2784 2256
WIRE 3200 2256 3008 2256
WIRE 3376 2256 3200 2256
WIRE 3552 2256 3376 2256
WIRE 3728 2256 3552 2256
WIRE 3936 2256 3728 2256
WIRE 4160 2256 3936 2256
WIRE 4400 2256 4160 2256
WIRE 4528 2256 4528 1936
WIRE 4528 2256 4400 2256
WIRE 2608 2304 2528 2304
WIRE 2784 2304 2704 2304
WIRE 3008 2304 2912 2304
WIRE 3200 2304 3104 2304
WIRE 3376 2304 3296 2304
WIRE 3552 2304 3472 2304
WIRE 3728 2304 3648 2304
WIRE 3936 2304 3840 2304
WIRE 4160 2304 4064 2304
WIRE 4400 2304 4320 2304
WIRE 2528 2352 2528 2304
WIRE 2528 2352 2384 2352
WIRE 2608 2352 2528 2352
WIRE 2704 2352 2704 2304
WIRE 2704 2352 2608 2352
WIRE 2784 2352 2704 2352
WIRE 2912 2352 2912 2304
WIRE 2912 2352 2784 2352
WIRE 3008 2352 2912 2352
WIRE 3104 2352 3104 2304
WIRE 3104 2352 3008 2352
WIRE 3200 2352 3104 2352
WIRE 3296 2352 3296 2304
WIRE 3296 2352 3200 2352
WIRE 3376 2352 3296 2352
WIRE 3472 2352 3472 2304
WIRE 3472 2352 3376 2352
WIRE 3552 2352 3472 2352
WIRE 3648 2352 3648 2304
WIRE 3648 2352 3552 2352
WIRE 3728 2352 3648 2352
WIRE 3840 2352 3840 2304
WIRE 3840 2352 3728 2352
WIRE 3936 2352 3840 2352
WIRE 4064 2352 4064 2304
WIRE 4064 2352 3936 2352
WIRE 4160 2352 4064 2352
WIRE 4320 2352 4320 2304
WIRE 4320 2352 4160 2352
WIRE 4400 2352 4320 2352
WIRE 4624 2352 4624 2032
WIRE 4624 2352 4400 2352
WIRE 2656 2384 2656 2336
WIRE 2672 2384 2656 2384
WIRE 2832 2384 2832 2336
WIRE 2832 2384 2672 2384
WIRE 3056 2384 3056 2336
WIRE 3056 2384 2832 2384
WIRE 3248 2384 3248 2336
WIRE 3248 2384 3056 2384
WIRE 3424 2384 3424 2336
WIRE 3424 2384 3248 2384
WIRE 3600 2384 3600 2336
WIRE 3600 2384 3424 2384
WIRE 3776 2384 3776 2336
WIRE 3776 2384 3600 2384
WIRE 3984 2384 3984 2336
WIRE 3984 2384 3776 2384
WIRE 4208 2384 4208 2336
WIRE 4208 2384 3984 2384
WIRE 4448 2384 4448 2336
WIRE 4448 2384 4208 2384
WIRE 2672 2448 2672 2384
WIRE 2480 2608 2480 2256
WIRE 2576 2608 2480 2608
WIRE 2816 2608 2576 2608
WIRE 3040 2608 2816 2608
WIRE 3248 2608 3040 2608
WIRE 3424 2608 3248 2608
WIRE 3600 2608 3424 2608
WIRE 3776 2608 3600 2608
WIRE 3968 2608 3776 2608
WIRE 4192 2608 3968 2608
WIRE 4368 2608 4192 2608
WIRE 2656 2656 2576 2656
WIRE 2912 2656 2816 2656
WIRE 3136 2656 3040 2656
WIRE 3328 2656 3248 2656
WIRE 3504 2656 3424 2656
WIRE 3680 2656 3600 2656
WIRE 3872 2656 3776 2656
WIRE 4064 2656 3968 2656
WIRE 4272 2656 4192 2656
WIRE 4448 2656 4368 2656
WIRE 2384 2704 2384 2352
WIRE 2576 2704 2384 2704
WIRE 2656 2704 2656 2656
WIRE 2656 2704 2576 2704
WIRE 2816 2704 2656 2704
WIRE 2912 2704 2912 2656
WIRE 2912 2704 2816 2704
WIRE 3040 2704 2912 2704
WIRE 3136 2704 3136 2656
WIRE 3136 2704 3040 2704
WIRE 3248 2704 3136 2704
WIRE 3328 2704 3328 2656
WIRE 3328 2704 3248 2704
WIRE 3424 2704 3328 2704
WIRE 3504 2704 3504 2656
WIRE 3504 2704 3424 2704
WIRE 3600 2704 3504 2704
WIRE 3680 2704 3680 2656
WIRE 3680 2704 3600 2704
WIRE 3776 2704 3680 2704
WIRE 3872 2704 3872 2656
WIRE 3872 2704 3776 2704
WIRE 3968 2704 3872 2704
WIRE 4064 2704 4064 2656
WIRE 4064 2704 3968 2704
WIRE 4192 2704 4064 2704
WIRE 4272 2704 4272 2656
WIRE 4272 2704 4192 2704
WIRE 4368 2704 4272 2704
WIRE 4448 2704 4448 2656
WIRE 4448 2704 4368 2704
WIRE 2528 2736 2528 2688
WIRE 2768 2736 2768 2688
WIRE 2768 2736 2528 2736
WIRE 2992 2736 2992 2688
WIRE 2992 2736 2768 2736
WIRE 3200 2736 3200 2688
WIRE 3200 2736 2992 2736
WIRE 3376 2736 3376 2688
WIRE 3376 2736 3200 2736
WIRE 3552 2736 3552 2688
WIRE 3552 2736 3376 2736
WIRE 3728 2736 3728 2688
WIRE 3728 2736 3552 2736
WIRE 3920 2736 3920 2688
WIRE 3920 2736 3728 2736
WIRE 4144 2736 4144 2688
WIRE 4144 2736 3920 2736
WIRE 4320 2736 4320 2688
WIRE 4320 2736 4144 2736
WIRE 2528 2768 2528 2736
WIRE 4368 2768 4368 2704
FLAG 192 1152 0
FLAG 1440 2032 0
FLAG 688 880 0
FLAG 2256 1344 0
FLAG -96 816 A
IOPIN -96 816 In
FLAG 176 992 A
IOPIN 176 992 In
FLAG -96 496 A
IOPIN -96 496 In
FLAG 480 128 A
IOPIN 480 128 In
FLAG 1552 352 A
IOPIN 1552 352 In
FLAG 1536 896 A
IOPIN 1536 896 In
FLAG 1328 1616 A
IOPIN 1328 1616 In
FLAG 2096 1600 A
IOPIN 2096 1600 In
FLAG 480 288 B
IOPIN 480 288 In
FLAG -96 992 B
IOPIN -96 992 In
FLAG 624 992 B
IOPIN 624 992 In
FLAG 480 496 B
IOPIN 480 496 In
FLAG 2016 128 B
IOPIN 2016 128 In
FLAG 2032 896 B
IOPIN 2032 896 In
FLAG 1328 1792 B
IOPIN 1328 1792 In
FLAG 1536 1776 B
IOPIN 1536 1776 In
FLAG 816 1616 _A
IOPIN 816 1616 In
FLAG 1520 1600 _A
IOPIN 1520 1600 In
FLAG 1536 672 _A
IOPIN 1536 672 In
FLAG 1552 128 _A
IOPIN 1552 128 In
FLAG 1136 128 CIN
IOPIN 1136 128 In
FLAG -96 128 _CIN
IOPIN -96 128 In
FLAG 272 816 _CIN
IOPIN 272 816 In
FLAG 1152 672 _CIN
IOPIN 1152 672 In
FLAG 816 1792 _B
IOPIN 816 1792 In
FLAG 2096 1776 _B
IOPIN 2096 1776 In
FLAG 2016 352 _B
IOPIN 2016 352 In
FLAG 2048 672 _B
IOPIN 2048 672 In
FLAG 192 -48 VDD
IOPIN 192 -48 BiDir
FLAG 1552 -112 VDD
IOPIN 1552 -112 BiDir
FLAG 2256 832 VDD
IOPIN 2256 832 BiDir
FLAG 688 352 VDD
IOPIN 688 352 BiDir
FLAG 1968 1280 CIN
IOPIN 1968 1280 In
FLAG 960 1296 _CIN
IOPIN 960 1296 In
FLAG 2064 1104 _S
FLAG 2368 1104 S
FLAG 512 640 _CO
FLAG 880 640 CO
FLAG 176 1520 0
FLAG 560 1536 0
FLAG -256 1536 0
FLAG 176 1264 A
FLAG 560 1264 B
FLAG -256 1264 CIN
FLAG -384 352 VDD
IOPIN -384 352 BiDir
FLAG -384 864 0
FLAG -576 608 CIN
FLAG -224 608 _CIN
FLAG -512 1488 0
FLAG -512 1296 VDD
FLAG -912 352 VDD
IOPIN -912 352 BiDir
FLAG -912 864 0
FLAG -1104 608 A
FLAG -752 608 _A
FLAG -928 1072 VDD
IOPIN -928 1072 BiDir
FLAG -928 1584 0
FLAG -1120 1328 B
FLAG -768 1328 _B
FLAG 2544 1488 0
FLAG 2528 2096 0
FLAG 2528 2768 0
FLAG 2672 1792 0
FLAG 2672 2448 0
FLAG 2720 -928 0
FLAG 2704 -320 0
FLAG 2704 352 0
FLAG 2848 -624 0
FLAG 2848 32 0
FLAG 4368 2768 0
FLAG 4544 384 0
SYMBOL pmos4 -32 48 R0
SYMATTR InstName M1
SYMATTR Value pch
SYMATTR Value2 l=130n w=780n
SYMBOL pmos4 416 48 M0
SYMATTR InstName M2
SYMATTR Value pch
SYMATTR Value2 l=130n w=1560n
SYMBOL pmos4 416 208 M0
SYMATTR InstName M3
SYMATTR Value pch
SYMATTR Value2 l=130n w=1560n
SYMBOL pmos4 416 416 M0
SYMATTR InstName M4
SYMATTR Value pch
SYMATTR Value2 l=130n w=780n
SYMBOL pmos4 -32 416 R0
SYMATTR InstName M5
SYMATTR Value pch
SYMATTR Value2 l=130n w=780n
SYMBOL nmos4 -32 736 R0
SYMATTR InstName M6
SYMATTR Value nch
SYMATTR Value2 l=130n w=260n
SYMBOL nmos4 -32 912 R0
SYMATTR InstName M7
SYMATTR Value nch
SYMATTR Value2 l=130n w=260n
SYMBOL nmos4 352 736 R0
SYMATTR InstName M8
SYMATTR Value nch
SYMATTR Value2 l=130n w=260n
SYMBOL nmos4 240 912 R0
SYMATTR InstName M9
SYMATTR Value nch
SYMATTR Value2 l=130n w=260n
SYMBOL nmos4 544 912 M0
SYMATTR InstName M10
SYMATTR Value nch
SYMATTR Value2 l=130n w=260n
SYMBOL pmos4 640 464 R0
SYMATTR InstName M11
SYMATTR Value pch
SYMATTR Value2 l=130n w=390n
SYMBOL nmos4 640 704 R0
SYMATTR InstName M12
SYMATTR Value nch
SYMATTR Value2 l=130n w=130n
SYMBOL pmos4 1232 48 R0
SYMATTR InstName M13
SYMATTR Value pch
SYMATTR Value2 l=130n w=780n
SYMBOL pmos4 1232 592 R0
SYMATTR InstName M18
SYMATTR Value pch
SYMATTR Value2 l=130n w=780n
SYMBOL nmos4 1040 1216 R0
SYMATTR InstName M23
SYMATTR Value nch
SYMATTR Value2 l=130n w=260n
SYMBOL nmos4 1840 1200 M0
SYMATTR InstName M24
SYMATTR Value nch
SYMATTR Value2 l=130n w=260n
SYMBOL pmos4 2208 928 R0
SYMATTR InstName M33
SYMATTR Value pch
SYMATTR Value2 l=130n w=390n
SYMBOL nmos4 2208 1168 R0
SYMATTR InstName M34
SYMATTR Value nch
SYMATTR Value2 l=130n w=130n
SYMBOL voltage -256 1344 R0
WINDOW 123 0 0 Left 0
WINDOW 39 0 0 Left 0
SYMATTR InstName CIN
SYMATTR Value PULSE(1.8 0 0 10p 10p 1n 2n)
SYMBOL voltage 176 1344 R0
WINDOW 123 0 0 Left 0
WINDOW 39 0 0 Left 0
SYMATTR InstName A
SYMATTR Value PULSE(1.8 1.8 0 10p 10p 2n 4n)
SYMBOL voltage 560 1344 R0
WINDOW 123 0 0 Left 0
WINDOW 39 0 0 Left 0
SYMATTR InstName B
SYMATTR Value PULSE(0 0 0 10p 10p 3n 6n)
SYMBOL nmos4 -432 624 R0
SYMATTR InstName M36
SYMATTR Value nch
SYMATTR Value2 l=130n w=130n
SYMBOL pmos4 -432 448 R0
SYMATTR InstName M35
SYMATTR Value pch
SYMATTR Value2 l=130n w=390n
SYMBOL voltage -512 1344 R0
WINDOW 123 0 0 Left 0
WINDOW 39 0 0 Left 0
SYMATTR InstName VDD
SYMATTR Value 1.8
SYMBOL pmos4 1632 48 R0
SYMATTR InstName M14
SYMATTR Value pch
SYMATTR Value2 l=130n w=780n
SYMBOL pmos4 1936 48 M0
SYMATTR InstName M15
SYMATTR Value pch
SYMATTR Value2 l=130n w=780n
SYMBOL pmos4 1632 272 R0
SYMATTR InstName M16
SYMATTR Value pch
SYMATTR Value2 l=130n w=780n
SYMBOL pmos4 1936 272 M0
SYMATTR InstName M17
SYMATTR Value pch
SYMATTR Value2 l=130n w=780n
SYMBOL pmos4 1632 592 R0
SYMATTR InstName M19
SYMATTR Value pch
SYMATTR Value2 l=130n w=780n
SYMBOL pmos4 1936 592 M0
SYMATTR InstName M20
SYMATTR Value pch
SYMATTR Value2 l=130n w=780n
SYMBOL pmos4 1632 816 R0
SYMATTR InstName M21
SYMATTR Value pch
SYMATTR Value2 l=130n w=780n
SYMBOL pmos4 1936 816 M0
SYMATTR InstName M22
SYMATTR Value pch
SYMATTR Value2 l=130n w=780n
SYMBOL nmos4 896 1536 R0
SYMATTR InstName M25
SYMATTR Value nch
SYMATTR Value2 l=130n w=520n
SYMBOL nmos4 1248 1536 M0
SYMATTR InstName M26
SYMATTR Value nch
SYMATTR Value2 l=130n w=520n
SYMBOL nmos4 896 1712 R0
SYMATTR InstName M27
SYMATTR Value nch
SYMATTR Value2 l=130n w=520n
SYMBOL nmos4 1248 1712 M0
SYMATTR InstName M28
SYMATTR Value nch
SYMATTR Value2 l=130n w=520n
SYMBOL nmos4 1632 1520 R0
SYMATTR InstName M29
SYMATTR Value nch
SYMATTR Value2 l=130n w=520n
SYMBOL nmos4 1984 1520 M0
SYMATTR InstName M30
SYMATTR Value nch
SYMATTR Value2 l=130n w=520n
SYMBOL nmos4 1632 1696 R0
SYMATTR InstName M31
SYMATTR Value nch
SYMATTR Value2 l=130n w=520n
SYMBOL nmos4 1984 1696 M0
SYMATTR InstName M32
SYMATTR Value nch
SYMATTR Value2 l=130n w=520n
SYMBOL nmos4 -960 624 R0
SYMATTR InstName M37
SYMATTR Value nch
SYMATTR Value2 l=130n w=130n
SYMBOL pmos4 -960 448 R0
SYMATTR InstName M38
SYMATTR Value pch
SYMATTR Value2 l=130n w=390n
SYMBOL nmos4 -976 1344 R0
SYMATTR InstName M39
SYMATTR Value nch
SYMATTR Value2 l=130n w=130n
SYMBOL pmos4 -976 1168 R0
SYMATTR InstName M40
SYMATTR Value pch
SYMATTR Value2 l=130n w=390n
SYMBOL nmos4 2544 1328 R0
SYMATTR InstName M41
SYMATTR Value nch
SYMATTR Value2 l=130n w=1000n
SYMBOL nmos4 2784 1328 R0
SYMATTR InstName M42
SYMATTR Value nch
SYMATTR Value2 l=130n w=1000n
SYMBOL nmos4 3008 1328 R0
SYMATTR InstName M43
SYMATTR Value nch
SYMATTR Value2 l=130n w=1000n
SYMBOL nmos4 3216 1328 R0
SYMATTR InstName M44
SYMATTR Value nch
SYMATTR Value2 l=130n w=1000n
SYMBOL nmos4 3392 1328 R0
SYMATTR InstName M45
SYMATTR Value nch
SYMATTR Value2 l=130n w=1000n
SYMBOL nmos4 3568 1328 R0
SYMATTR InstName M46
SYMATTR Value nch
SYMATTR Value2 l=130n w=1000n
SYMBOL nmos4 3744 1328 R0
SYMATTR InstName M47
SYMATTR Value nch
SYMATTR Value2 l=130n w=1000n
SYMBOL nmos4 3936 1328 R0
SYMATTR InstName M48
SYMATTR Value nch
SYMATTR Value2 l=130n w=1000n
SYMBOL nmos4 4160 1328 R0
SYMATTR InstName M49
SYMATTR Value nch
SYMATTR Value2 l=130n w=1000n
SYMBOL nmos4 4336 1328 R0
SYMATTR InstName M50
SYMATTR Value nch
SYMATTR Value2 l=130n w=1000n
SYMBOL nmos4 4464 1584 M0
SYMATTR InstName M51
SYMATTR Value nch
SYMATTR Value2 l=130n w=1000n
SYMBOL nmos4 4224 1584 M0
SYMATTR InstName M52
SYMATTR Value nch
SYMATTR Value2 l=130n w=1000n
SYMBOL nmos4 4000 1584 M0
SYMATTR InstName M53
SYMATTR Value nch
SYMATTR Value2 l=130n w=1000n
SYMBOL nmos4 3792 1584 M0
SYMATTR InstName M54
SYMATTR Value nch
SYMATTR Value2 l=130n w=1000n
SYMBOL nmos4 3616 1584 M0
SYMATTR InstName M55
SYMATTR Value nch
SYMATTR Value2 l=130n w=1000n
SYMBOL nmos4 3440 1584 M0
SYMATTR InstName M56
SYMATTR Value nch
SYMATTR Value2 l=130n w=1000n
SYMBOL nmos4 3264 1584 M0
SYMATTR InstName M57
SYMATTR Value nch
SYMATTR Value2 l=130n w=1000n
SYMBOL nmos4 3072 1584 M0
SYMATTR InstName M58
SYMATTR Value nch
SYMATTR Value2 l=130n w=1000n
SYMBOL nmos4 2848 1584 M0
SYMATTR InstName M59
SYMATTR Value nch
SYMATTR Value2 l=130n w=1000n
SYMBOL nmos4 2672 1584 M0
SYMATTR InstName M60
SYMATTR Value nch
SYMATTR Value2 l=130n w=1000n
SYMBOL nmos4 2528 1936 R0
SYMATTR InstName M81
SYMATTR Value nch
SYMATTR Value2 l=130n w=1000n
SYMBOL nmos4 2768 1936 R0
SYMATTR InstName M82
SYMATTR Value nch
SYMATTR Value2 l=130n w=1000n
SYMBOL nmos4 2992 1936 R0
SYMATTR InstName M83
SYMATTR Value nch
SYMATTR Value2 l=130n w=1000n
SYMBOL nmos4 3200 1936 R0
SYMATTR InstName M84
SYMATTR Value nch
SYMATTR Value2 l=130n w=1000n
SYMBOL nmos4 3376 1936 R0
SYMATTR InstName M85
SYMATTR Value nch
SYMATTR Value2 l=130n w=1000n
SYMBOL nmos4 3552 1936 R0
SYMATTR InstName M86
SYMATTR Value nch
SYMATTR Value2 l=130n w=1000n
SYMBOL nmos4 3728 1936 R0
SYMATTR InstName M87
SYMATTR Value nch
SYMATTR Value2 l=130n w=1000n
SYMBOL nmos4 3920 1936 R0
SYMATTR InstName M88
SYMATTR Value nch
SYMATTR Value2 l=130n w=1000n
SYMBOL nmos4 4144 1936 R0
SYMATTR InstName M89
SYMATTR Value nch
SYMATTR Value2 l=130n w=1000n
SYMBOL nmos4 4320 1936 R0
SYMATTR InstName M90
SYMATTR Value nch
SYMATTR Value2 l=130n w=1000n
SYMBOL nmos4 4448 2256 M0
SYMATTR InstName M91
SYMATTR Value nch
SYMATTR Value2 l=130n w=1000n
SYMBOL nmos4 4208 2256 M0
SYMATTR InstName M92
SYMATTR Value nch
SYMATTR Value2 l=130n w=1000n
SYMBOL nmos4 3984 2256 M0
SYMATTR InstName M93
SYMATTR Value nch
SYMATTR Value2 l=130n w=1000n
SYMBOL nmos4 3776 2256 M0
SYMATTR InstName M94
SYMATTR Value nch
SYMATTR Value2 l=130n w=1000n
SYMBOL nmos4 3600 2256 M0
SYMATTR InstName M95
SYMATTR Value nch
SYMATTR Value2 l=130n w=1000n
SYMBOL nmos4 3424 2256 M0
SYMATTR InstName M96
SYMATTR Value nch
SYMATTR Value2 l=130n w=1000n
SYMBOL nmos4 3248 2256 M0
SYMATTR InstName M97
SYMATTR Value nch
SYMATTR Value2 l=130n w=1000n
SYMBOL nmos4 3056 2256 M0
SYMATTR InstName M98
SYMATTR Value nch
SYMATTR Value2 l=130n w=1000n
SYMBOL nmos4 2832 2256 M0
SYMATTR InstName M99
SYMATTR Value nch
SYMATTR Value2 l=130n w=1000n
SYMBOL nmos4 2656 2256 M0
SYMATTR InstName M100
SYMATTR Value nch
SYMATTR Value2 l=130n w=1000n
SYMBOL nmos4 2528 2608 R0
SYMATTR InstName M101
SYMATTR Value nch
SYMATTR Value2 l=130n w=1000n
SYMBOL nmos4 2768 2608 R0
SYMATTR InstName M102
SYMATTR Value nch
SYMATTR Value2 l=130n w=1000n
SYMBOL nmos4 2992 2608 R0
SYMATTR InstName M103
SYMATTR Value nch
SYMATTR Value2 l=130n w=1000n
SYMBOL nmos4 3200 2608 R0
SYMATTR InstName M104
SYMATTR Value nch
SYMATTR Value2 l=130n w=1000n
SYMBOL nmos4 3376 2608 R0
SYMATTR InstName M105
SYMATTR Value nch
SYMATTR Value2 l=130n w=1000n
SYMBOL nmos4 3552 2608 R0
SYMATTR InstName M106
SYMATTR Value nch
SYMATTR Value2 l=130n w=1000n
SYMBOL nmos4 3728 2608 R0
SYMATTR InstName M107
SYMATTR Value nch
SYMATTR Value2 l=130n w=1000n
SYMBOL nmos4 3920 2608 R0
SYMATTR InstName M108
SYMATTR Value nch
SYMATTR Value2 l=130n w=1000n
SYMBOL nmos4 4144 2608 R0
SYMATTR InstName M109
SYMATTR Value nch
SYMATTR Value2 l=130n w=1000n
SYMBOL nmos4 4320 2608 R0
SYMATTR InstName M110
SYMATTR Value nch
SYMATTR Value2 l=130n w=1000n
SYMBOL nmos4 2720 -1088 R0
SYMATTR InstName M141
SYMATTR Value nch
SYMATTR Value2 l=130n w=1000n
SYMBOL nmos4 2960 -1088 R0
SYMATTR InstName M142
SYMATTR Value nch
SYMATTR Value2 l=130n w=1000n
SYMBOL nmos4 3184 -1088 R0
SYMATTR InstName M143
SYMATTR Value nch
SYMATTR Value2 l=130n w=1000n
SYMBOL nmos4 3392 -1088 R0
SYMATTR InstName M144
SYMATTR Value nch
SYMATTR Value2 l=130n w=1000n
SYMBOL nmos4 3568 -1088 R0
SYMATTR InstName M145
SYMATTR Value nch
SYMATTR Value2 l=130n w=1000n
SYMBOL nmos4 3744 -1088 R0
SYMATTR InstName M146
SYMATTR Value nch
SYMATTR Value2 l=130n w=1000n
SYMBOL nmos4 3920 -1088 R0
SYMATTR InstName M147
SYMATTR Value nch
SYMATTR Value2 l=130n w=1000n
SYMBOL nmos4 4112 -1088 R0
SYMATTR InstName M148
SYMATTR Value nch
SYMATTR Value2 l=130n w=1000n
SYMBOL nmos4 4336 -1088 R0
SYMATTR InstName M149
SYMATTR Value nch
SYMATTR Value2 l=130n w=1000n
SYMBOL nmos4 4512 -1088 R0
SYMATTR InstName M150
SYMATTR Value nch
SYMATTR Value2 l=130n w=1000n
SYMBOL nmos4 4640 -832 M0
SYMATTR InstName M151
SYMATTR Value nch
SYMATTR Value2 l=130n w=1000n
SYMBOL nmos4 4400 -832 M0
SYMATTR InstName M152
SYMATTR Value nch
SYMATTR Value2 l=130n w=1000n
SYMBOL nmos4 4176 -832 M0
SYMATTR InstName M153
SYMATTR Value nch
SYMATTR Value2 l=130n w=1000n
SYMBOL nmos4 3968 -832 M0
SYMATTR InstName M154
SYMATTR Value nch
SYMATTR Value2 l=130n w=1000n
SYMBOL nmos4 3792 -832 M0
SYMATTR InstName M155
SYMATTR Value nch
SYMATTR Value2 l=130n w=1000n
SYMBOL nmos4 3616 -832 M0
SYMATTR InstName M156
SYMATTR Value nch
SYMATTR Value2 l=130n w=1000n
SYMBOL nmos4 3440 -832 M0
SYMATTR InstName M157
SYMATTR Value nch
SYMATTR Value2 l=130n w=1000n
SYMBOL nmos4 3248 -832 M0
SYMATTR InstName M158
SYMATTR Value nch
SYMATTR Value2 l=130n w=1000n
SYMBOL nmos4 3024 -832 M0
SYMATTR InstName M159
SYMATTR Value nch
SYMATTR Value2 l=130n w=1000n
SYMBOL nmos4 2848 -832 M0
SYMATTR InstName M160
SYMATTR Value nch
SYMATTR Value2 l=130n w=1000n
SYMBOL nmos4 2704 -480 R0
SYMATTR InstName M161
SYMATTR Value nch
SYMATTR Value2 l=130n w=1000n
SYMBOL nmos4 2944 -480 R0
SYMATTR InstName M162
SYMATTR Value nch
SYMATTR Value2 l=130n w=1000n
SYMBOL nmos4 3168 -480 R0
SYMATTR InstName M163
SYMATTR Value nch
SYMATTR Value2 l=130n w=1000n
SYMBOL nmos4 3376 -480 R0
SYMATTR InstName M164
SYMATTR Value nch
SYMATTR Value2 l=130n w=1000n
SYMBOL nmos4 3552 -480 R0
SYMATTR InstName M165
SYMATTR Value nch
SYMATTR Value2 l=130n w=1000n
SYMBOL nmos4 3728 -480 R0
SYMATTR InstName M166
SYMATTR Value nch
SYMATTR Value2 l=130n w=1000n
SYMBOL nmos4 3904 -480 R0
SYMATTR InstName M167
SYMATTR Value nch
SYMATTR Value2 l=130n w=1000n
SYMBOL nmos4 4096 -480 R0
SYMATTR InstName M168
SYMATTR Value nch
SYMATTR Value2 l=130n w=1000n
SYMBOL nmos4 4320 -480 R0
SYMATTR InstName M169
SYMATTR Value nch
SYMATTR Value2 l=130n w=1000n
SYMBOL nmos4 4496 -480 R0
SYMATTR InstName M170
SYMATTR Value nch
SYMATTR Value2 l=130n w=1000n
SYMBOL nmos4 4624 -160 M0
SYMATTR InstName M171
SYMATTR Value nch
SYMATTR Value2 l=130n w=1000n
SYMBOL nmos4 4384 -160 M0
SYMATTR InstName M172
SYMATTR Value nch
SYMATTR Value2 l=130n w=1000n
SYMBOL nmos4 4160 -160 M0
SYMATTR InstName M173
SYMATTR Value nch
SYMATTR Value2 l=130n w=1000n
SYMBOL nmos4 3952 -160 M0
SYMATTR InstName M174
SYMATTR Value nch
SYMATTR Value2 l=130n w=1000n
SYMBOL nmos4 3776 -160 M0
SYMATTR InstName M175
SYMATTR Value nch
SYMATTR Value2 l=130n w=1000n
SYMBOL nmos4 3600 -160 M0
SYMATTR InstName M176
SYMATTR Value nch
SYMATTR Value2 l=130n w=1000n
SYMBOL nmos4 3424 -160 M0
SYMATTR InstName M177
SYMATTR Value nch
SYMATTR Value2 l=130n w=1000n
SYMBOL nmos4 3232 -160 M0
SYMATTR InstName M178
SYMATTR Value nch
SYMATTR Value2 l=130n w=1000n
SYMBOL nmos4 3008 -160 M0
SYMATTR InstName M179
SYMATTR Value nch
SYMATTR Value2 l=130n w=1000n
SYMBOL nmos4 2832 -160 M0
SYMATTR InstName M180
SYMATTR Value nch
SYMATTR Value2 l=130n w=1000n
SYMBOL nmos4 2704 192 R0
SYMATTR InstName M181
SYMATTR Value nch
SYMATTR Value2 l=130n w=1000n
SYMBOL nmos4 2944 192 R0
SYMATTR InstName M182
SYMATTR Value nch
SYMATTR Value2 l=130n w=1000n
SYMBOL nmos4 3168 192 R0
SYMATTR InstName M183
SYMATTR Value nch
SYMATTR Value2 l=130n w=1000n
SYMBOL nmos4 3376 192 R0
SYMATTR InstName M184
SYMATTR Value nch
SYMATTR Value2 l=130n w=1000n
SYMBOL nmos4 3552 192 R0
SYMATTR InstName M185
SYMATTR Value nch
SYMATTR Value2 l=130n w=1000n
SYMBOL nmos4 3728 192 R0
SYMATTR InstName M186
SYMATTR Value nch
SYMATTR Value2 l=130n w=1000n
SYMBOL nmos4 3904 192 R0
SYMATTR InstName M187
SYMATTR Value nch
SYMATTR Value2 l=130n w=1000n
SYMBOL nmos4 4096 192 R0
SYMATTR InstName M188
SYMATTR Value nch
SYMATTR Value2 l=130n w=1000n
SYMBOL nmos4 4320 192 R0
SYMATTR InstName M189
SYMATTR Value nch
SYMATTR Value2 l=130n w=1000n
SYMBOL nmos4 4496 192 R0
SYMATTR InstName M190
SYMATTR Value nch
SYMATTR Value2 l=130n w=1000n
TEXT -128 72 Left 2 ;6/1
TEXT -112 424 Left 2 ;6/1
TEXT 456 416 Left 2 ;6/1
TEXT 448 56 Left 2 ;12/1
TEXT 448 224 Left 2 ;12/1
TEXT -112 728 Left 2 ;2/1
TEXT -96 928 Left 2 ;2/1
TEXT 464 736 Left 2 ;2/1
TEXT 576 920 Left 2 ;2/1
TEXT 192 912 Left 2 ;2/1
TEXT 1000 1240 Left 2 ;2/1
TEXT 1864 1232 Left 2 ;2/1
TEXT 1592 1512 Left 2 ;4/1
TEXT 1984 1504 Left 2 ;4/1
TEXT 1576 1680 Left 2 ;4/1
TEXT 1984 1688 Left 2 ;4/1
TEXT 1256 1520 Left 2 ;4/1
TEXT 1248 1688 Left 2 ;4/1
TEXT 832 1536 Left 2 ;4/1
TEXT 832 1720 Left 2 ;4/1
TEXT -72 1664 Left 2 !.include 130nm_bulk.lib
TEXT -72 1704 Left 2 !.tran 0 20n 0 10p
TEXT -64 1752 Left 2 ;Gia su Wp = 3Wn
TEXT 1064 632 Left 2 ;6/1
TEXT 1072 64 Left 2 ;6/1
TEXT 1560 32 Left 2 ;6/1
TEXT 1992 40 Left 2 ;6/1
TEXT 1992 256 Left 2 ;6/1
TEXT 1496 280 Left 2 ;6/1
TEXT 1504 592 Left 2 ;6/1
TEXT 2040 592 Left 2 ;6/1
TEXT 2000 832 Left 2 ;6/1
TEXT 1480 824 Left 2 ;6/1
TEXT 2744 712 Left 2 !.measure tran P_avg AVG -V(VDD)*I(VDD) from=10n to=20n

The netlist it stands for:
* 22200162.asc
M1 VDD _CIN N003 VDD pch l=130n w=780n
M2 VDD A N001 VDD pch l=130n w=1560n
M3 N001 B N003 N001 pch l=130n w=1560n
M4 N003 B _CO N003 pch l=130n w=780n
M5 N003 A _CO N003 pch l=130n w=780n
M6 _CO A N006 N006 nch l=130n w=260n
M7 N006 B 0 0 nch l=130n w=260n
M8 _CO _CIN N007 N007 nch l=130n w=260n
M9 N007 A 0 0 nch l=130n w=260n
M10 N007 B 0 0 nch l=130n w=260n
M11 VDD _CO CO VDD pch l=130n w=390n
M12 CO _CO 0 0 nch l=130n w=130n
M13 VDD CIN N004 VDD pch l=130n w=780n
M18 N004 _CIN _S N004 pch l=130n w=780n
M23 _S _CIN N009 N009 nch l=130n w=260n
M24 _S CIN N008 N008 nch l=130n w=260n
M33 VDD _S S VDD pch l=130n w=390n
M34 S _S 0 0 nch l=130n w=130n
V§CIN CIN 0 PULSE(1.8 0 0 10p 10p 1n 2n)
V§A A 0 PULSE(1.8 1.8 0 10p 10p 2n 4n)
V§B B 0 PULSE(0 0 0 10p 10p 3n 6n)
M36 _CIN CIN 0 0 nch l=130n w=130n
M35 VDD CIN _CIN VDD pch l=130n w=390n
VDD VDD 0 1.8
M14 VDD _A N002 VDD pch l=130n w=780n
M15 VDD B N002 VDD pch l=130n w=780n
M16 N002 A N004 N002 pch l=130n w=780n
M17 N002 _B N004 N002 pch l=130n w=780n
M19 N004 _A N005 N004 pch l=130n w=780n
M20 N004 _B N005 N004 pch l=130n w=780n
M21 N005 A _S N005 pch l=130n w=780n
M22 N005 B _S N005 pch l=130n w=780n
M25 N009 _A N012 N012 nch l=130n w=520n
M26 N009 A N013 N013 nch l=130n w=520n
M27 N012 _B 0 0 nch l=130n w=520n
M28 N013 B 0 0 nch l=130n w=520n
M29 N008 _A N010 N010 nch l=130n w=520n
M30 N008 A N011 N011 nch l=130n w=520n
M31 N010 B 0 0 nch l=130n w=520n
M32 N011 _B 0 0 nch l=130n w=520n
M37 _A A 0 0 nch l=130n w=130n
M38 VDD A _A VDD pch l=130n w=390n
M39 _B B 0 0 nch l=130n w=130n
M40 VDD B _B VDD pch l=130n w=390n
M41 S 0 0 0 nch l=130n w=1000n
M42 S 0 0 0 nch l=130n w=1000n
M43 S 0 0 0 nch l=130n w=1000n
M44 S 0 0 0 nch l=130n w=1000n
M45 S 0 0 0 nch l=130n w=1000n
M46 S 0 0 0 nch l=130n w=1000n
M47 S 0 0 0 nch l=130n w=1000n
M48 S 0 0 0 nch l=130n w=1000n
M49 S 0 0 0 nch l=130n w=1000n
M50 S 0 0 0 nch l=130n w=1000n
M51 S 0 0 0 nch l=130n w=1000n
M52 S 0 0 0 nch l=130n w=1000n
M53 S 0 0 0 nch l=130n w=1000n
M54 S 0 0 0 nch l=130n w=1000n
M55 S 0 0 0 nch l=130n w=1000n
M56 S 0 0 0 nch l=130n w=1000n
M57 S 0 0 0 nch l=130n w=1000n
M58 S 0 0 0 nch l=130n w=1000n
M59 S 0 0 0 nch l=130n w=1000n
M60 S 0 0 0 nch l=130n w=1000n
M81 S 0 0 0 nch l=130n w=1000n
M82 S 0 0 0 nch l=130n w=1000n
M83 S 0 0 0 nch l=130n w=1000n
M84 S 0 0 0 nch l=130n w=1000n
M85 S 0 0 0 nch l=130n w=1000n
M86 S 0 0 0 nch l=130n w=1000n
M87 S 0 0 0 nch l=130n w=1000n
M88 S 0 0 0 nch l=130n w=1000n
M89 S 0 0 0 nch l=130n w=1000n
M90 S 0 0 0 nch l=130n w=1000n
M91 S 0 0 0 nch l=130n w=1000n
M92 S 0 0 0 nch l=130n w=1000n
M93 S 0 0 0 nch l=130n w=1000n
M94 S 0 0 0 nch l=130n w=1000n
M95 S 0 0 0 nch l=130n w=1000n
M96 S 0 0 0 nch l=130n w=1000n
M97 S 0 0 0 nch l=130n w=1000n
M98 S 0 0 0 nch l=130n w=1000n
M99 S 0 0 0 nch l=130n w=1000n
M100 S 0 0 0 nch l=130n w=1000n
M101 S 0 0 0 nch l=130n w=1000n
M102 S 0 0 0 nch l=130n w=1000n
M103 S 0 0 0 nch l=130n w=1000n
M104 S 0 0 0 nch l=130n w=1000n
M105 S 0 0 0 nch l=130n w=1000n
M106 S 0 0 0 nch l=130n w=1000n
M107 S 0 0 0 nch l=130n w=1000n
M108 S 0 0 0 nch l=130n w=1000n
M109 S 0 0 0 nch l=130n w=1000n
M110 S 0 0 0 nch l=130n w=1000n
M141 CO 0 0 0 nch l=130n w=1000n
M142 CO 0 0 0 nch l=130n w=1000n
M143 CO 0 0 0 nch l=130n w=1000n
M144 CO 0 0 0 nch l=130n w=1000n
M145 CO 0 0 0 nch l=130n w=1000n
M146 CO 0 0 0 nch l=130n w=1000n
M147 CO 0 0 0 nch l=130n w=1000n
M148 CO 0 0 0 nch l=130n w=1000n
M149 CO 0 0 0 nch l=130n w=1000n
M150 CO 0 0 0 nch l=130n w=1000n
M151 CO 0 0 0 nch l=130n w=1000n
M152 CO 0 0 0 nch l=130n w=1000n
M153 CO 0 0 0 nch l=130n w=1000n
M154 CO 0 0 0 nch l=130n w=1000n
M155 CO 0 0 0 nch l=130n w=1000n
M156 CO 0 0 0 nch l=130n w=1000n
M157 CO 0 0 0 nch l=130n w=1000n
M158 CO 0 0 0 nch l=130n w=1000n
M159 CO 0 0 0 nch l=130n w=1000n
M160 CO 0 0 0 nch l=130n w=1000n
M161 CO 0 0 0 nch l=130n w=1000n
M162 CO 0 0 0 nch l=130n w=1000n
M163 CO 0 0 0 nch l=130n w=1000n
M164 CO 0 0 0 nch l=130n w=1000n
M165 CO 0 0 0 nch l=130n w=1000n
M166 CO 0 0 0 nch l=130n w=1000n
M167 CO 0 0 0 nch l=130n w=1000n
M168 CO 0 0 0 nch l=130n w=1000n
M169 CO 0 0 0 nch l=130n w=1000n
M170 CO 0 0 0 nch l=130n w=1000n
M171 CO 0 0 0 nch l=130n w=1000n
M172 CO 0 0 0 nch l=130n w=1000n
M173 CO 0 0 0 nch l=130n w=1000n
M174 CO 0 0 0 nch l=130n w=1000n
M175 CO 0 0 0 nch l=130n w=1000n
M176 CO 0 0 0 nch l=130n w=1000n
M177 CO 0 0 0 nch l=130n w=1000n
M178 CO 0 0 0 nch l=130n w=1000n
M179 CO 0 0 0 nch l=130n w=1000n
M180 CO 0 0 0 nch l=130n w=1000n
M181 CO 0 0 0 nch l=130n w=1000n
M182 CO 0 0 0 nch l=130n w=1000n
M183 CO 0 0 0 nch l=130n w=1000n
M184 CO 0 0 0 nch l=130n w=1000n
M185 CO 0 0 0 nch l=130n w=1000n
M186 CO 0 0 0 nch l=130n w=1000n
M187 CO 0 0 0 nch l=130n w=1000n
M188 CO 0 0 0 nch l=130n w=1000n
M189 CO 0 0 0 nch l=130n w=1000n
M190 CO 0 0 0 nch l=130n w=1000n
.model NMOS NMOS
.model PMOS PMOS
.lib standard.mos
* 6/1
* 6/1
* 6/1
* 12/1
* 12/1
* 2/1
* 2/1
* 2/1
* 2/1
* 2/1
* 2/1
* 2/1
* 4/1
* 4/1
* 4/1
* 4/1
* 4/1
* 4/1
* 4/1
* 4/1
.include 130nm_bulk.lib
.tran 0 20n 0 10p
* Gia su Wp = 3Wn
* 6/1
* 6/1
* 6/1
* 6/1
* 6/1
* 6/1
* 6/1
* 6/1
* 6/1
* 6/1
.measure tran P_avg AVG -V(VDD)*I(VDD) from=10n to=20n
.backanno
.end